# EAGLE design sma_antenna (EAGLE 9.6.2)
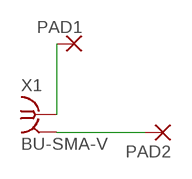
[diagram p0: schematic, sheet 1]

## Parts
PAD1  3,81/1,4  [3,81/1,4]
PAD2  3,81/1,4  [3,81/1,4]
X1  BU-SMA-V  [BU-SMA-V]

## Nets
N$1: PAD1.1(P) X1.1
N$2: PAD2.1(P) X1.2 X1.3 X1.4 X1.5

## Library data of the parts
PAD1 PAD2 = wirepad:3,81/1,4: THROUGH-HOLE PAD
X1 = con-coax:BU-SMA-V: FEMALE SMA CONNECTOR Radiall distributor RS 112-3794; OC_FARNELL: unknown; OC_NEWARK: unknown

## Board
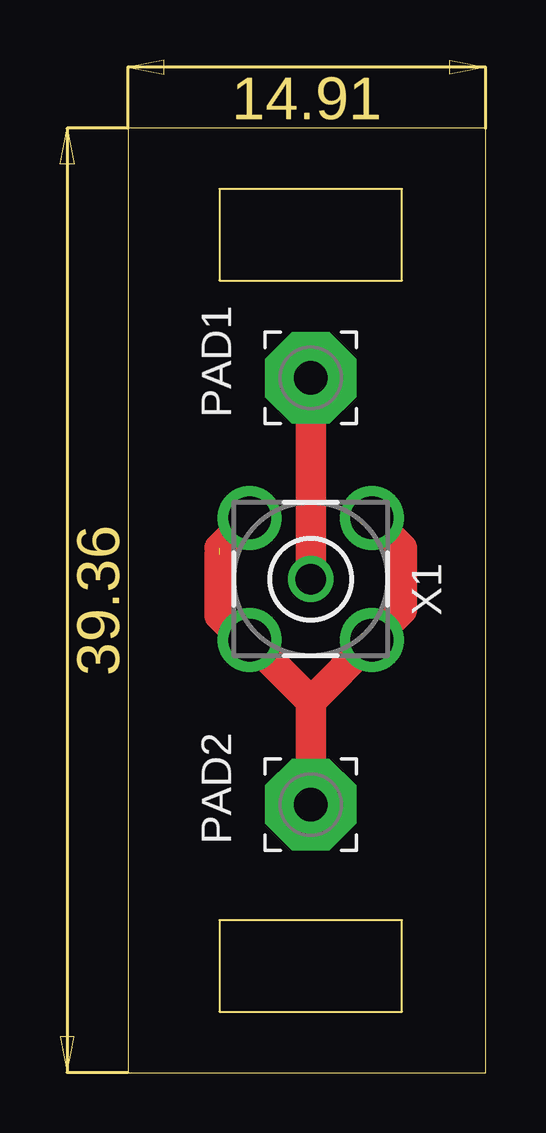
[diagram p1: board, top side]

Size 14.91 x 39.36 mm. Coordinates in mm from the lower left corner, seen from the top.
Outline: 0,0 14.91,0 14.91,39.36 0,39.36 0,0
Outline: 3.81,6.35 3.81,2.54 11.43,2.54 11.43,6.35 3.81,6.35
Outline: 3.81,36.83 3.81,33.02 11.43,33.02 11.43,36.83 3.81,36.83
Copper layers (1*16): Top 0.035mm / dielectric 1.5mm / Bottom 0.035mm
Design rules "default": minimum track width 6mil, minimum drill 0.35mm, track to track 6mil, track to pad 6mil, pad to pad 6mil, via to via 6mil, smd to smd 6mil, copper to edge 40mil, drill to drill 6mil, minimum pad ring 10mil, minimum via ring 8mil, stop-mask expansion 4mil, vias tented up to drill 0mil, thermal gap 10mil

### Footprints (pad centres in the part's own frame; a part is rotated, then mirrored left to right if it is on the bottom)
3,81/1,4 = drill 1.397 pad 3.81 octagon: 1 0,0
BU-SMA-V = drill 1.27: 1 0,0 | drill 1.778: 2 -2.55,2.55; 3 2.55,2.55; 4 2.55,-2.55; 5 -2.55,-2.55

### Placement (x,y rotation side)
PAD1  7.62,28.96 0 top
PAD2  7.62,11.18 0 top
X1  7.62,20.57 0 top

### Tracks (layer width: path | path; a pad name or v marks a point on that pad's centre or on a via)
N$1
  Top 1.27: PAD1.1 X1.1
N$2  (1 unrouted)
  Top 1.27: X1.2 3.81,21.86 | X1.5 4.84,18.02 3.81,19.05 3.81,21.59 | X1.5 5.31,17.78 | X1.5 7.62,15.47 | 7.62,15.47 PAD2.1 | X1.3 11.43,21.86 11.43,19.28 X1.4 7.62,15.47